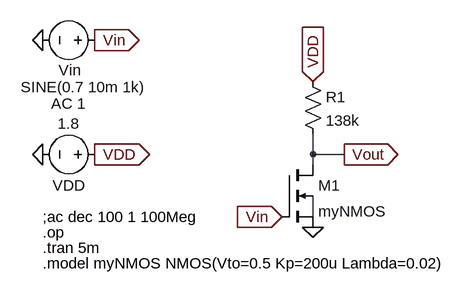
[diagram p0: schematic Simple_NMOS_Amplifier.asc]
Simple_NMOS_Amplifier.asc, the LTspice schematic file:
Version 4
SHEET 1 880 680
WIRE 480 -288 480 -320
WIRE 528 -288 480 -288
WIRE 480 -272 480 -288
WIRE 480 -192 480 -224
FLAG 64 -288 0
FLAG 480 -176 0
FLAG 528 -288 Vout
IOPIN 528 -288 Out
FLAG 144 -288 VDD
IOPIN 144 -288 Out
FLAG 480 -400 VDD
IOPIN 480 -400 In
FLAG 64 -464 0
FLAG 144 -464 Vin
IOPIN 144 -464 Out
FLAG 432 -192 Vin
IOPIN 432 -192 In
SYMBOL voltage 160 -464 R90
WINDOW 123 98 30 VRight 2
WINDOW 39 0 0 Left 0
WINDOW 0 46 37 VRight 2
WINDOW 3 72 -62 VRight 2
SYMATTR Value2 AC 1
SYMATTR InstName Vin
SYMATTR Value SINE(0.7 10m 1k)
SYMBOL voltage 160 -288 R90
WINDOW 0 32 56 VTop 2
WINDOW 3 -32 56 VBottom 2
WINDOW 123 0 0 Left 0
WINDOW 39 0 0 Left 0
SYMATTR InstName VDD
SYMATTR Value 1.8
SYMBOL res 464 -416 R0
SYMATTR InstName R1
SYMATTR Value 138k
SYMBOL nmos4 432 -272 R0
SYMATTR InstName M1
SYMATTR Value myNMOS
SYMATTR Value2 l=1u w=2u
TEXT 64 -144 Left 2 !.tran 5m
TEXT 64 -192 Left 2 !;ac dec 100 1 100Meg
TEXT 64 -168 Left 2 !.op
TEXT 64 -120 Left 2 !.model myNMOS NMOS(Vto=0.5 Kp=200u Lambda=0.02)

The netlist it stands for:
* Simple_NMOS_Amplifier.asc
Vin Vin 0 SINE(0.7 10m 1k) AC 1
VDD VDD 0 1.8
R1 VDD Vout 138k
M1 Vout Vin 0 N001 myNMOS l=1u w=2u
.model NMOS NMOS
.model PMOS PMOS
.lib standard.mos
.tran 5m
;ac dec 100 1 100Meg
.op
.model myNMOS NMOS(Vto=0.5 Kp=200u Lambda=0.02)
.backanno
.end